# EAGLE schematic GB204-VP-1 (EAGLE 7.6.0)
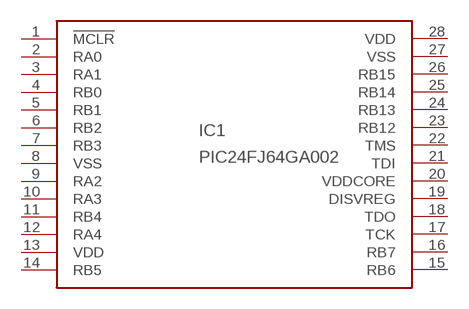
[diagram p0: schematic, sheet 1]

## Parts
IC1  PIC24FJ64GA002  [DIL28-3]
Unconnected: IC1.1(!MCLR) IC1.2(RA0) IC1.3(RA1) IC1.4(RB0) IC1.5(RB1) IC1.6(RB2) IC1.7(RB3) IC1.9(RA2) IC1.10(RA3) IC1.11(RB4) IC1.12(RA4) IC1.14(RB5) IC1.15(RB6) IC1.16(RB7) IC1.17(TCK) IC1.18(TDO) IC1.19(DISVREG) IC1.21(TDI) IC1.22(TMS) IC1.23(RB12) IC1.24(RB13) IC1.25(RB14) IC1.26(RB15)

## Power pins joined to a net without a drawn wire
VDD: IC1.13(VDD) IC1.28(VDD)
VDDCORE: IC1.20(VDDCORE)
VSS: IC1.8(VSS) IC1.27(VSS)

## Library data of the parts
IC1 = microchip:PIC24FJ64GA002: PIC24FJ64GA002 edit this description Auto generated by make-symbol-device-package-bsdl.ulp Rev. 25 Source: PIC24FJ64GA002.bsd; MPN: PIC24FJ64GA002-I/SP; OC_FARNELL: 1332298; OC_NEWARK: 88K6132